# EAGLE schematic usb_uart (EAGLE 6.4)
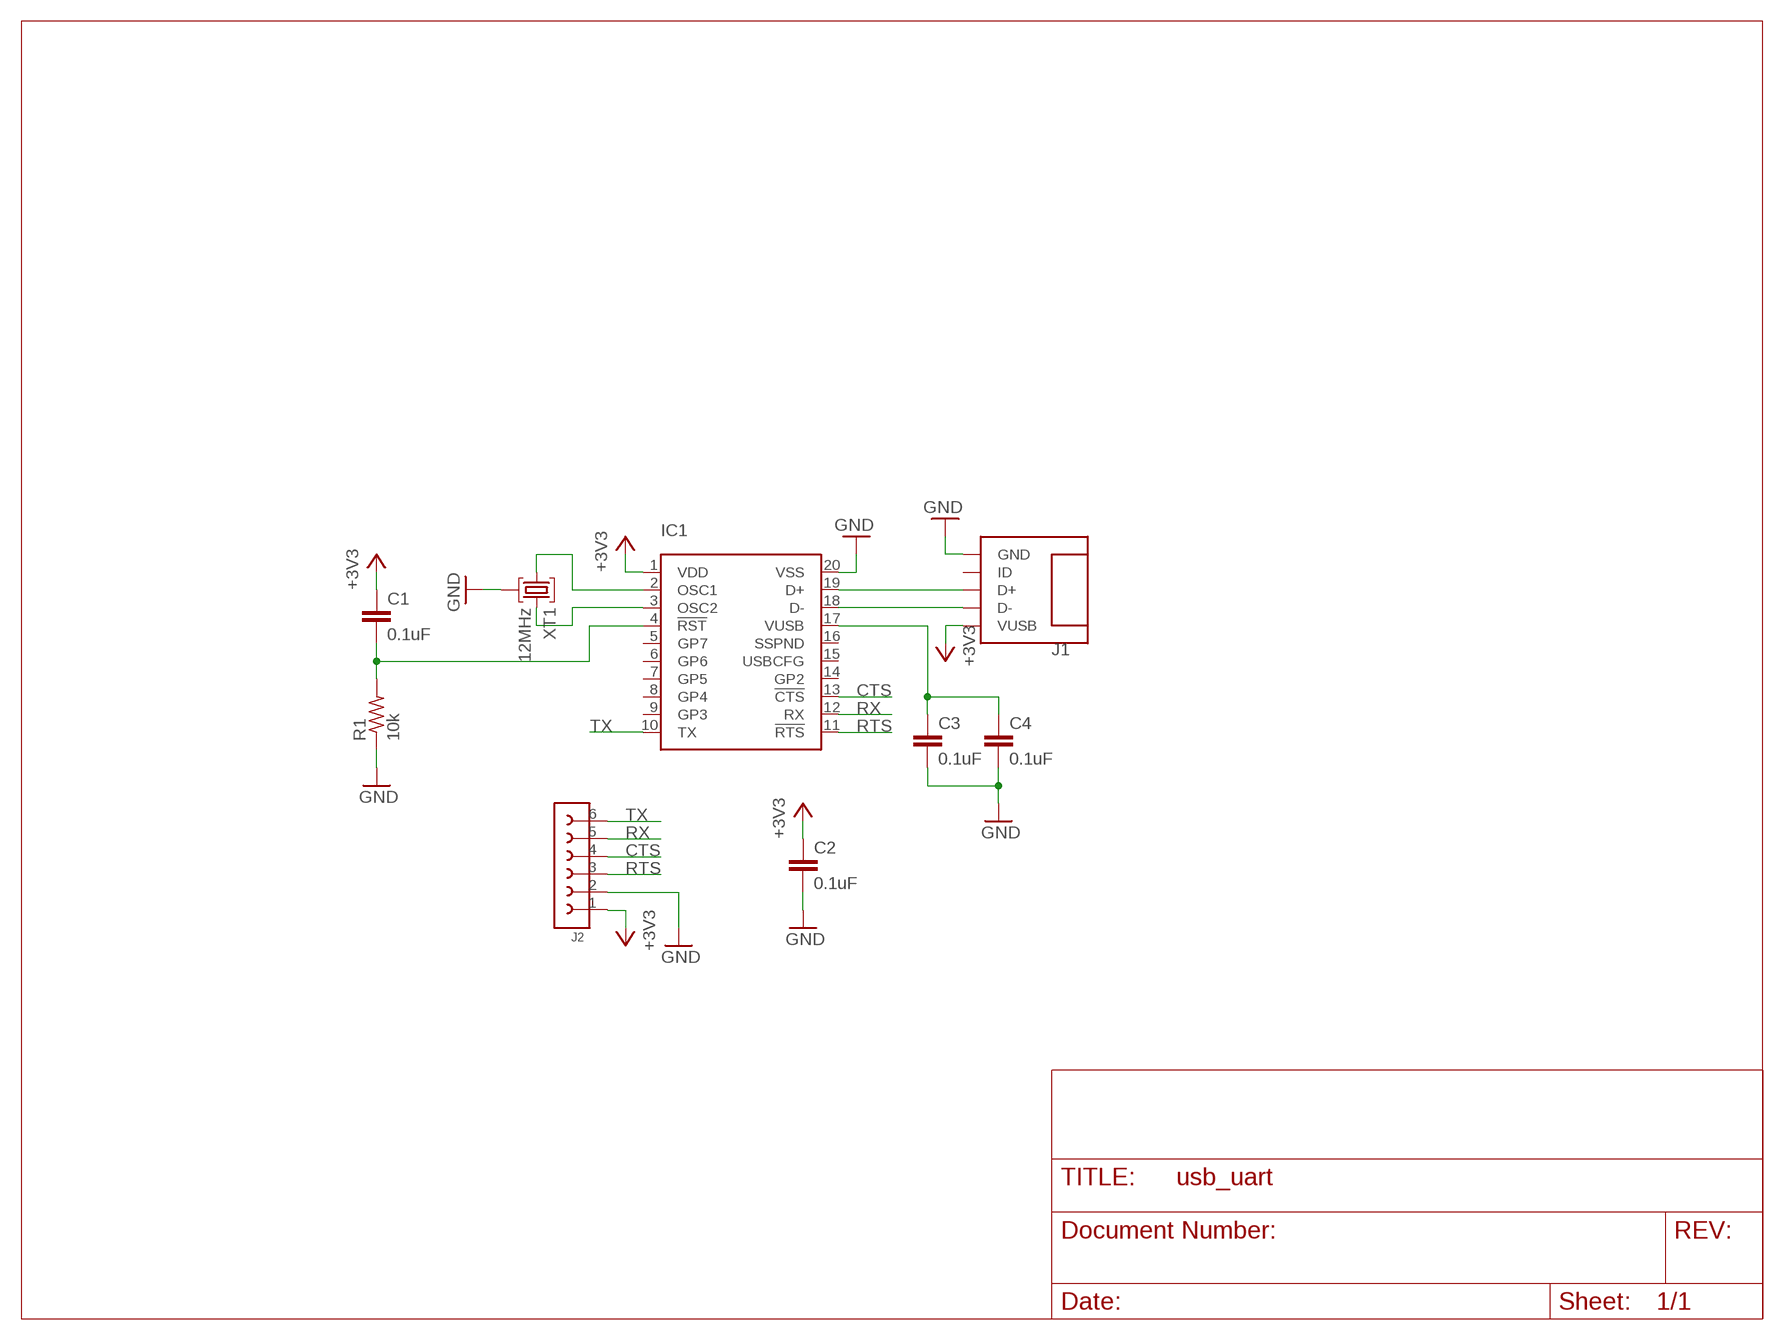
[diagram p0: schematic, sheet 1]

## Parts
C1  0.1uF  C0603C104Z3VAC  [CAPC0603]
C2  0.1uF  C0603C104Z3VAC  [CAPC0603]
C3  0.1uF  C0603C104Z3VAC  [CAPC0603]
C4  0.1uF  C0603C104Z3VAC  [CAPC0603]
IC1  MCP2200-I/SS  [SOP65P775X200-20M]
J1  -1734035-1  [USB-MINIB-SMD+SMD+RET]
J2  61300611121  [PHSP254P1524X254X1154-6S]
R1  10k  CRG0603F10K10  [RESC0603]
XT1  12MHz  AWSCR-12.00MGD-C  [CERAMIC740X340-3N]

## Nets
+3V3: C1.1 C2.1 IC1.1(VDD) J1.1(VUSB) J2.1
CTS: IC1.13(!CTS) J2.4
GND: C2.2 C3.2 C4.2 IC1.20(VSS) J1.5(GND) J2.2 R1.P$1 XT1.2
N$1: IC1.2(OSC1) XT1.1
N$2: IC1.3(OSC2) XT1.3
N$3: C1.2 IC1.4(!RST) R1.P$2
N$4: IC1.19(D+) J1.3(D+)
N$5: IC1.18(D-) J1.2(D-)
N$9: C3.1 C4.1 IC1.17(VUSB)
RTS: IC1.11(!RTS) J2.3
RX: IC1.12(RX) J2.5
TX: IC1.10(TX) J2.6
Unconnected: IC1.5(GP7) IC1.6(GP6) IC1.7(GP5) IC1.8(GP4) IC1.9(GP3) IC1.14(GP2) IC1.15(USBCFG) IC1.16(SSPND) J1.4(ID)

## Library data of the parts
C1-C4 = kemet-capacitors-ceramic:C?C*VAC: Y5V Dielectric, 6.3 – 50 VDC (Commercial Grade) Description OVERVIEW: KEMET’s Y5V dielectric features an 85°C maximum operating temperature and is considered “general-purpose.” The Electronics Components, Assemblies & Materials Association (EIA) characterizes Z5U dielectric as a Class III material. Components of this classiﬁ cation are ﬁ xed, ceramic dielectric capacitors suited for bypass and decoupling or other applications in which dielectric losses, high insulation resistance and capacitance stability are not of major importance. Y5V exhibits a predictable change in capacitance with respect to time and voltage and displays wide variations in capacitance with reference to ambient temperature. Capacitance change is limited to +22%, -82% from -30°C to +85°C. APPLICATIONS: Typical applications include limited temperature, decoupling and bypass. BENEFITS • -30°C to +85°C operating temperature range • Pb-Free and RoHS Compliant • EIA 0402, 0603, 0805, 1206, and 1210 case sizes • DC voltage ratings of 6.3 V, 10 V, 16 V, 25 V, and 50 V • Capacitance offerings ranging from 0.022 μF to 22 μF • Available capacitance tolerance of +80%/ -20% • Non-polar device, minimizing installation concerns • 100% pure matte tin-plated termination ﬁ nish that allowing for excellent solderability How to Order C 1210 C 226 Z 4 V A C TU Capacitor Class Case Size Specification Series Capacitance Code (pF) Capacitance Tolerance Voltage Dielectric Failure Rate/Design Termination Finish Packaging Grade C = Ceramic 0402 0603 0805 1206 1210 C = Standart 2 signiﬁ cant digits + number of zeros. Use 9 for 1.0 – 9.9 pF Use 8 for 0.5 – .99 pF e.g., 2.2 pF = 229 e.g., 0.5 pF = 508 Z = +80%/-20% 9 = 6.3V 8 = 10V 4 = 16V 3 = 25V 5 = 50 V V = Y5V A = N/A A = 100% Matte Blank = Bulk TU = 7" Reel Unmarked. Ref: Datasheet <http://www.kemet.com/kemet/web/homepage/kechome.nsf/weben/B79D94FAACCDEFCE852579F10063745E/$file/KEM_CC101_COMM_SMD.pdf> Add more variants to C@VAC, just remplace the "@" with a new technologie named according to order code parameters. It is mandatory to fill up the following attributes MANUFACTURER, DESCRIPTION, MOUSER, AVNET, ARROW, FUTURE, NEWARK, DIGIKEY, AVRG-PRICE, OCTOPART-LINK, DATASHEET; DATASHEET: http://www.kemet.com/kemet/web/homepage/kechome.nsf/weben/B79D94FAACCDEFCE852579F10063745E/$file/KEM_CC101_COMM_SMD.pdf; DESCRIPTION: Capacitores cerámicos de capas múltiples (MLCC) - SMD/SMT0603 25volts 0.1uF Y5V -20+80%; EAGLEUP: CAPC0603; M-PRICE: 0.1; MANUFACTURER: KEMET; MOUSER: 80-C0603C104Z3V; OCTOPART-LINK: http://octopart.com/c0603c104z3vactu-kemet-98662
IC1 = mchp-interface:MCP2200?: USB 2.0 to UART Protocol Converter with GPIO Description The MCP2200 is a USB-to-UART serial converter which enables USB connectivity in application that have a UART interface. The device reduces external components by integrating the USB termination resistors. The MCP2200 also has 256-bytes of integrated user EEPROM. The MCP2200 has eight general purpose input / output pins. Four of the pins have alternate functions to indicate USB and communication status. FEATURES • Supports full-speed USB (12 Mb/s) • Implements USB protocol composite device: - Communication Device Class (CDC) for communications and configuration - Human Interface Device (HID) for I/O control • 128-byte buffer to handle data throughput at any UART baud rate: - 64-byte transmit - 64-byte receive • Fully configurable VID and PID assignments, and string descriptors • Bus powered or self-powered • USB 2.0 Compliant: TID 40001150 How to order Family Package MCP2200 SO = SOIC SS = TSSOP MQ = QFN Ref: Datasheet <http://ww1.microchip.com/downloads/en/DeviceDoc/22228B.pdf>; EAGLEUP: SOP65P775X200-28N
J1 = te-usb:?-1734035-1: USB MINIB R/A RCPT Description Product Type Features: Size = Mini Series = B Gender = Receptacle Orientation = Right Angle LED = Without PCB Mount Retention Type = SMT Hold Down Mechanical Attachment: Mount Location = Top Termination Features: Contact Termination Type = Surface Mount Termination Method = Solder Dimensions: PCB Thickness, Recommended (mm [in]) = 1.57 [0.062] How to order Common Part Type = Caractericitcs 1734035-1 = With retentive legs 1- = without retentive legs Ref: Datasheet <http://www.te.com/commerce/DocumentDelivery/DDEController?Action=showdoc&DocId=Customer+Drawing%7F1734035%7FE%7Fpdf%7FEnglish%7FENG_CD_1734035_E.pdf%7F1-1734035-2>; EAGLEUP: USB-MINIB-SMD+SMD+RET
J2 = wurth-pin-socket-headers:6130061?: (6) 2.54mm Pin Header Description MATERIAL INSULATOR: PBT FLAMABILITY RATING: UL94-V0 COLOR: BLACK CONTACT MATERIAL: COPPER ALLOY CONTACT TYPE: STAMPED CONTACT PLATING: GOLD QUALITY CLASS: 3 AS PER CECC 75 301-802 PITCH: 2.54MM ENVIRONMENTAL OPERATING TEMPERATURE: -40 UP TO 125°C COMPLIANCE: LEAD FREE AND ROHS ELECTRICAL CURRENT RATING: 3A WORKING VOLTAGE: 250V AC INSULATOR RESISTANCE: >1000 MOHM DIELECTRIC WITHSTANDING VOLTAGE: 500V AC/MN CONTACT RESISTANCE: 20 mOHM MAX DIMENSION B = 2.54 x NB POSITIONS How to order Type Header/Socket Number of Positions Variation 613 = 2.54mm Pitch from 1 to 40 1121 = Pin Header Straigh Post 1021 = Pin Header Right Angle 1821 = Socket Header Straigh Post 43121 = Socket Header Right Angle Ref: Datasheet <http://katalog.we-online.de/em/datasheet/6130xx11121.pdf> , Datasheet <http://katalog.we-online.de/em/datasheet/6130xx11021.pdf> , Datasheet <http://katalog.we-online.de/em/datasheet/6130xx11821.pdf> , Datasheet <http://katalog.we-online.de/em/datasheet/6130xx143121.pdf>; AVRG-PRICE: 0.41; DATASHEET: http://www.mouser.com/ds/2/445/6130xx11121-48870.pdf; DESCRIPTION: pin header straight post 2.54"; EAGLEUP: PHSP254P1524X254X1154-6S; MANUFACTURER: WURTH; MOUSER: 710-61300611121; OCTOPART-LINK: http://octopart.com/61300611121-w%C3%BCrth+elektronik+midcom-20084590
R1 = te-fixed-resistors:CRG?*: Thick Film Chip Resistors 1% and 5% tolerance Description Precious metal terminations are screen printed onto a ceramic base and fired. The resistive element is screen printed and fired and the passivation layer added. Each resistor is trimmed to tolerance by laser. The pre-scribed tile is broken into strips, the end plating is fired on and the strips broken into individual components. Final termination is made by electroplating. Key Features Thick film resistors with a high power to size ratio,ideally suited to industrial and general purpose use. A range from 1 ohm to 10M and tolerances of 1% and 5%. Also including zero ohm links. Suitable for most applications, including high frequency operation, owing to the short lead structure and low capacitance. Seven Package Sizes Terminal finish: Matte Sn MSL Level 2 How to order Common Part Size Tolerance Resistance Value CRG - Thick Film Chip Resistor 0201 0402 0603 0805 1206 2512 F - ±1% J - ±5% 1 ohm (1 ohm) 1R0 1K ohm (1000 ohms) 1K 100K ohm (100000 ohms) 100K 1M ohm (1000000 ohms) 1M Ref: Datasheet <http://www.te.com/commerce/DocumentDelivery/DDEController?Action=showdoc&DocId=Data+Sheet%7F1773204%7FH%7Fpdf%7FEnglish%7FENG_DS_1773204_H.pdf%7F1623095-1>; AVRG-PRICE: 0.1; DATASHEET: http://www.te.com/commerce/DocumentDelivery/DDEController?Action=showdoc&DocId=Data+Sheet%7F1773204%7FH%7Fpdf%7FEnglish%7FENG_DS_1773204_H.pdf%7F1623095-1; DESCRIPTION: Resistores de película gruesa - SMD CRG0603 1% 10K 10KRL; EAGLEUP: RESC0603; MOUSER: 279-CRG0603F10K/10; OCTOPART-LINK: http://octopart.com/crg0603f10k10-tyco+electronics-16077289
XT1 = abracon-resonators:AWSCR-*MGD-C: Built-in capacitance • Low Resonant impedance • 1.84MHz to 8MHz • 7.4 x 3.4 mm Description FEATURES: • Built-in load capacitors • Suitable for RoHS compliant reflow • Low cost solution for cost sensitive applications • Low resonant impedance APPLICATIONS: • Remote controls, Microprocessor clocks, DVD & CD-ROMs, Electric appliances • Consumer electronics How to Order Cristal Frequency in MHz Load Capacitance Packaging AWSCR 12.00MGD-C Contact ABRACON for Built-in Capacitance options Blank: Bulk T: Tape & Reel Ref: Datasheet <http://www.abracon.com/Resonators/AWSCR_MGD.pdf> Add more variants to AWSCR@, just remplace the "@" with a new technologie named according to order code parameters. It is mandatory to fill it up the following attributes MANUFACTURER, DESCRIPTION, MOUSER, AVNET, ARROW, FUTURE, NEWARK, DIGIKEY, AVRG-PRICE, OCTOPART-LINK, DATASHEET; EAGLEUP: CERAMIC740X340-3N; MANUFACTURER: ABRACON